# Altium schematic sheet Power_Schematic.SchDoc
size 300 x 200 mm; SheetNumber: 2; SheetTotal: 2
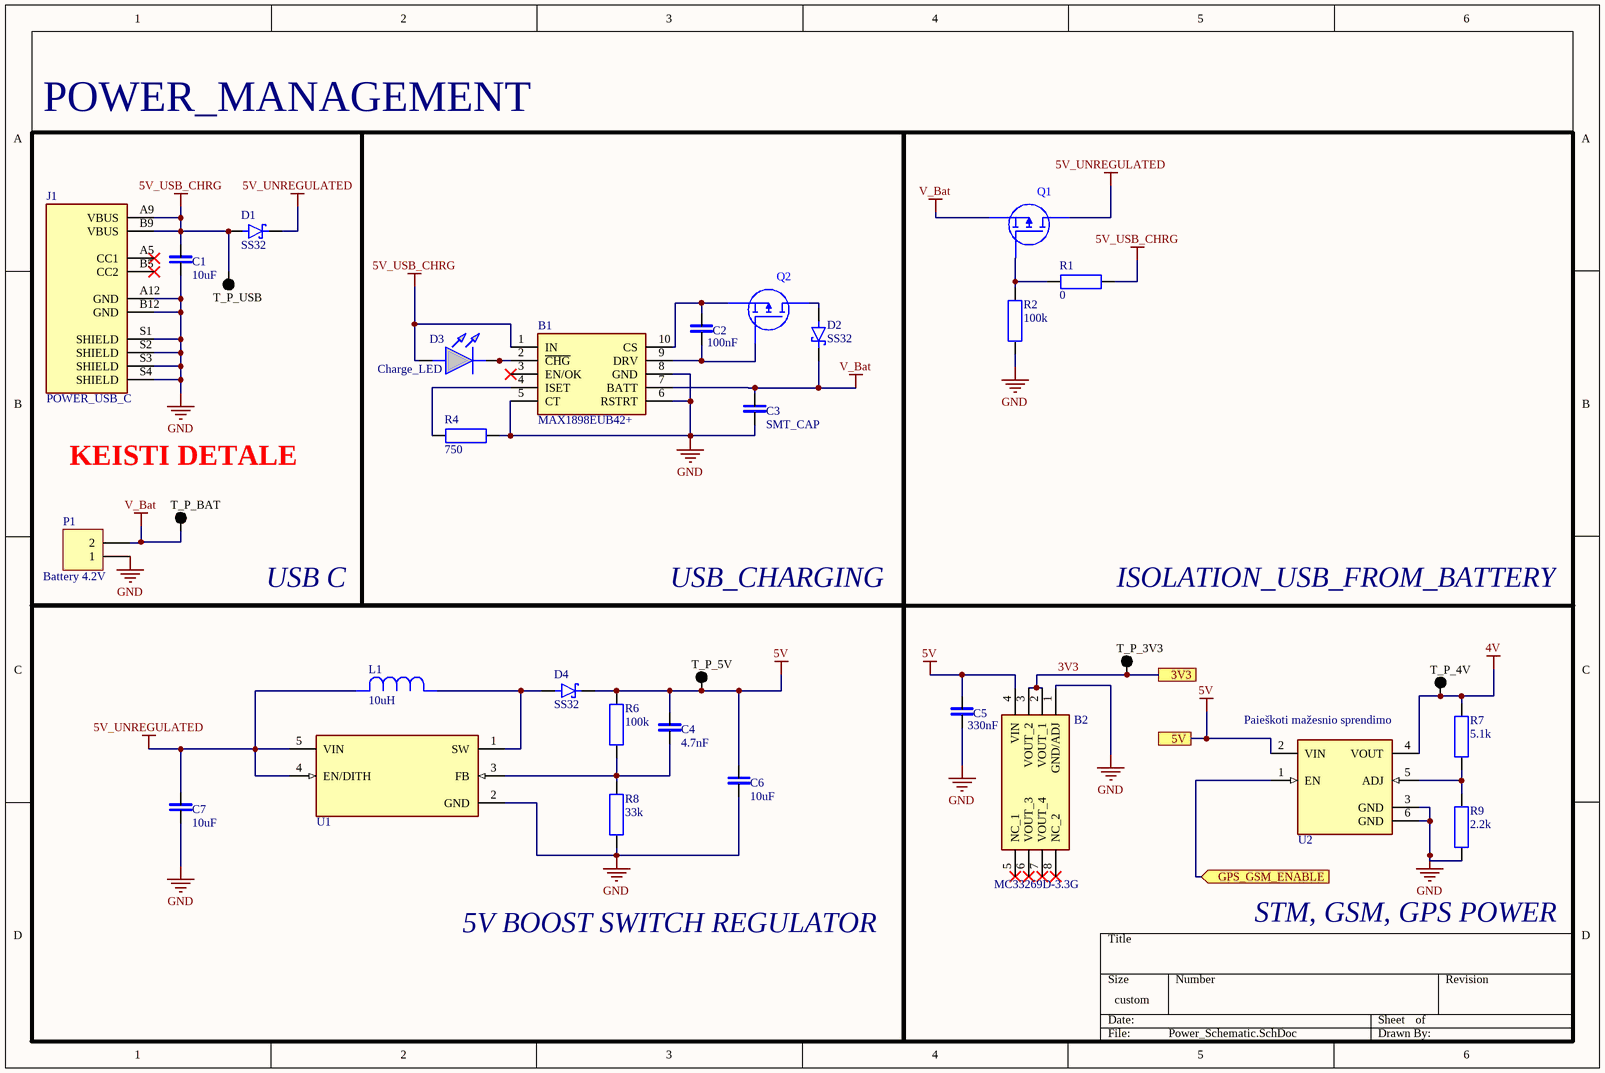
[diagram p0: Power_Schematic.SchDoc]

## Parts
B1  MAX1898EUB42+  [MAX1898EUB42]
B2  MC33269D-3.3G  [3V3Voltage_MC33269D-3.3G]
C1  10uF  [CAP_0805]
C2  100nF  [CAP_0805]
C3  SMT_CAP  [CAP_0805]
C4  4.7nF  [CAP_0805]
C5  330nF  [CAP_0805]
C6  10uF  [CAP_0805]
C7  10uF  [CAP_0805]
D1  SS32  [POWER_SCHOTKY_3A]
D2  SS32  [POWER_SCHOTKY_3A]
D3  Charge_LED  [LED_0805]
D4  SS32  [POWER_SCHOTKY_3A]
J1  POWER_USB_C  [POWER_USB_C]
L1  10uH  [MCSD54-4R7MU]
P1  Battery 4.2V  [HDR1X2]
Q1  MOSFET Pch -45V -4.5A  [P_CHANNEL_POWER_RD3H045SPTL1]  (value not drawn)
Q2  MOSFET Pch -45V -4.5A  [P_CHANNEL_POWER_RD3H045SPTL1]  (value not drawn)
R1  0  [RES_0805]
R2  100k  [RES_0805]
R4  750  [RES_0805]
R6  100k  [RES_0805]
R7  5.1k  [RES_0805]
R8  33k  [RES_0805]
R9  2.2k  [RES_0805]
T_P1  T_P_USB  [T_P]  (net tie, no BOM)
T_P2  T_P_BAT  [T_P]  (net tie, no BOM)
T_P3  T_P_3V3  [T_P]  (net tie, no BOM)
T_P4  T_P_5V  [T_P]  (net tie, no BOM)
T_P5  T_P_4V  [T_P]  (net tie, no BOM)
U1  Switch Voltage Regulator MIC2250-1YD5-TR  [Switching_MIC2250-1YD5-TR]  (value not drawn)
U2  1.24V-5V MIC37252WR  [1V24_5V_MIC37252WR]  (value not drawn)

## Blocks framed on the sheet
POWER_MANAGEMENT: B1 C1-C3 D1-D3 J1 P1 Q2 R4 T_P1 T_P2

## Ports
3V3, 5V, GPS_GSM_ENABLE (in)

## Nets
4V: R7.2 T_P5.1 U2.4(VOUT)
5V: B2.4(VIN) C4.2 C5.2 C6.2 D4.C(K) R6.2 T_P4.1 U2.2(VIN) ; port 5V
5V_UNREGULATED: C7.2 D1.C(K) L1.2 Q1.2(D) U1.4(EN/DITH) U1.5(VIN)
5V_USB_CHRG: B1.1(IN) C1.2 D1.A D3.2(A) J1.A9(VBUS) J1.B9(VBUS) R1.2 T_P1.1
GND: B1.5(CT) B1.6(RSTRT) B1.8(GND) B2.1(GND/ADJ) C1.1 C3.1 C5.1 C6.1 C7.1 J1.A12(GND) J1.B12(GND) J1.S1(SHIELD) J1.S2(SHIELD) J1.S3(SHIELD) J1.S4(SHIELD) P1.1 R2.1 R4.2 R8.1 R9.1 U1.2(GND) U2.3(GND) U2.6(GND)
V_Bat: B1.7(BATT) C3.2 D2.C(K) P1.2 Q1.3(S) T_P2.1
3V3: B2.2(VOUT_1) B2.3(VOUT_2) T_P3.1 ; port 3V3
GPS_GSM_ENABLE: U2.1(EN) ; port GPS_GSM_ENABLE
NetB1_2: B1.2(~{CHG}) D3.1(K)
NetB1_4: B1.4(ISET) R4.1
NetB1_9: B1.9(DRV) C2.1 Q2.1(G)
NetB1_10: B1.10(CS) C2.2 Q2.3(S)
NetC4_1: C4.1 R6.1 R8.2 U1.3(FB)
NetD2_A: D2.A Q2.2(D)
NetD4_A: D4.A L1.1 U1.1(SW)
NetQ1_1: Q1.1(G) R1.1 R2.2
NetR7_1: R7.1 R9.2 U2.5(ADJ)

Not connected (* = marked no-connect by the designer): B1 3(EN/OK)*; B2 5(NC_1)* 6(VOUT_3)* 7(VOUT_4)* 8(NC_2)*; J1 A5(CC1)* B5(CC2)*

## Notes on the sheet
- KEISTI DETALE
- USB C
- USB_CHARGING
- ISOLATION_USB_FROM_BATTERY
- Paieškoti mažesnio sprendimo
- 5V BOOST SWITCH REGULATOR
- STM, GSM, GPS POWER

## Library data of the parts
B1 = MAX1898EUB42+: Part: MAX1898EUB42+ BATT CHARGER, LI-ION, 4.2V; Manufacturer_Name: Analog Devices; Geometry.Height: 1.1mm; Manufacturer_Part_Number: MAX1898EUB42+; Mouser Part Number: 700-MAX1898EUB42; Mouser Price/Stock: https://www.mouser.co.uk/ProductDetail/Maxim-Integrated/MAX1898EUB42%2b?qs=LHmEVA8xxfaFlPLqK8C6rw%3D%3D; Arrow Part Number: MAX1898EUB42+; Arrow Price/Stock: https://www.arrow.com/en/products/max1898eub42/maxim-integrated?region=nac; Datasheet Link: https://datasheets.maximintegrated.com/en/ds/MAX1898.pdf
B2 = LDO3V3: Voltage regulator,Part: MC33269D-3.3G, Low Dropout Voltage Regulator, 0.8A 3.3; Manufacturer_Name: onsemi; Geometry.Height: 1.75mm; Manufacturer_Part_Number: MC33269D-3.3G; Mouser Part Number: 863-MC33269D-3.3G; Mouser Price/Stock: https://www.mouser.co.uk/ProductDetail/onsemi/MC33269D-33G?qs=dFKnUM%2FquJZ%252BBcrN2hd5Yg%3D%3D; Arrow Part Number: MC33269D-3.3G; Arrow Price/Stock: https://www.arrow.com/en/products/mc33269d-3.3g/on-semiconductor?region=europe; Datasheet Link: http://www.onsemi.com/pub/Collateral/MC33269-D.PDF
C1-C7 = SMT_CAP: MP: LD051A270KAB2A; Package: None; Price: None; Availability: Unavailable
D1 D2 D4 = POWER_SCHOTKY_3A: Part: SS32; MF: ON Semiconductor; Value: *; Price: None; Package: SMC-2 ON Semiconductor; Check_prices: https://www.snapeda.com/parts/SS32/Onsemi/view-part/?ref=eda; Purchase-URL: https://pricing.snapeda.com/search/part/SS32/?ref=eda; SnapEDA_Link: https://www.snapeda.com/parts/SS32/Onsemi/view-part/?ref=snap; Availability: In Stock; MP: SS32
D3 = LED: Part: HSMH-C170; Manufacturer_Name: Avago Technologies; Geometry.Height: 0.9mm; Manufacturer_Part_Number: HSMH-C170; Mouser Part Number: 630-HSMH-C170; Mouser Price/Stock: https://www.mouser.co.uk/ProductDetail/Broadcom-Avago/HSMH-C170?qs=YDL0qNrpDT6b21G9HrN9ig%3D%3D; Arrow Part Number: *; Arrow Price/Stock: *; Datasheet Link: https://docs.broadcom.com/docs/AV02-0551EN
J1 = POWER_USB_C: Type C USB Charging Connector part name : USB4515-GF-A_REVA; MF: Global Connector Technology; SnapEDA_Link: https://www.snapeda.com/parts/USB4515-GF-A/Global+Connector+Technology/view-part/?ref=snap; Package: None; Check_prices: https://www.snapeda.com/parts/USB4515-GF-A/Global+Connector+Technology/view-part/?ref=eda; Value: *; Digi-Key_Part_Number: 2073-USB4515-GF-ATR-ND; MP: USB4515-GF-A
L1 = IND: Part: MCSD54-4R7MU; Mfr_Name: Multicomp; Copyright: Copyright (C) 2023 Ultra Librarian. All rights reserved.; Manufacturer_Part_Number: MCSD54-4R7MU
P1 = Header 2: Header, 2-Pin; LatestRevisionDate: 17-Jul-2002; LatestRevisionNote: Re-released for DXP Platform.; Publisher: Altium Limited
Q1 Q2 = P_CHANNEL_POWER 4.5A RD3H045SPTL1: Part: RD3H045SPTL1; Manufacturer_Name: ROHM Semiconductor; GateName_1: G$1; SymbolName_1: RD3H045SPTL1; LibraryName: RD3H045SPTL1; DeviceSetName: RD3H045SPTL1; Package: RD3P175SNFRATL; Manufacturer_Part_Number: RD3H045SPTL1; Mouser_Part_Number: 755-RD3H045SPTL1; Mouser_Price-Stock: https://www.mouser.co.uk/ProductDetail/ROHM-Semiconductor/RD3H045SPTL1?qs=W0yvOO0ixfGBWnxPdnIMog%3D%3D; Height: mm
R1 R2 R4 R6-R9 = SMT_RES: Power_Rating: .25 W; MP: 2-2176053-0; Tolerance: 1%; Resistance: .33; MF: TE Connectivity; Price: None; Availability: In Stock; EU_RoHS_Compliance: Compliant with Exemptions; Package: 0805; Value: *; SnapEDA_Link: https://www.snapeda.com/parts/2-2176053-0/TE+Connectivity/view-part/?ref=snap; Check_prices: https://www.snapeda.com/parts/2-2176053-0/TE+Connectivity/view-part/?ref=eda
T_P1-T_P5 = T_P: Test_point
U1 = Switch Voltage Regulator MIC2250-1YD5-TR: Part: MIC2250-1YD5-TR / 2.5V to 5.5 V input / 1.24V to 32V output
U2 = 1.24V-5V MIC37252WR: Part: MIC37252WR